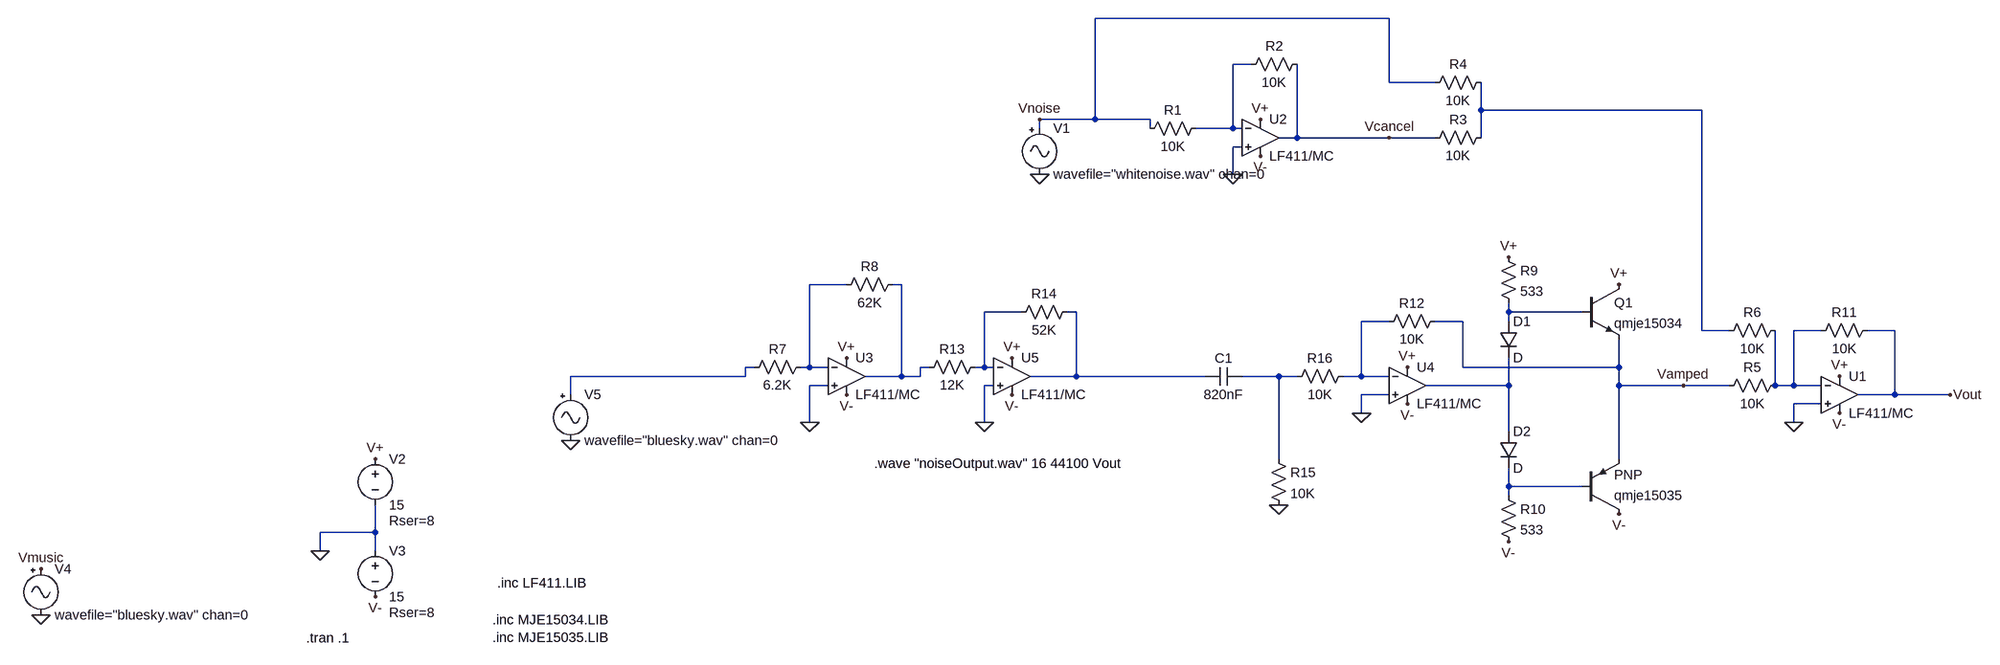
[diagram p0: schematic noiseCanceller.asc]
noiseCanceller.asc, the LTspice schematic file:
Version 4
SHEET 1 3320 732
WIRE 1968 -368 1456 -368
WIRE 1728 -288 1696 -288
WIRE 1968 -256 1968 -368
WIRE 2048 -256 1968 -256
WIRE 2128 -208 2128 -256
WIRE 2512 -208 2128 -208
WIRE 1456 -192 1456 -368
WIRE 1456 -192 1360 -192
WIRE 1552 -192 1456 -192
WIRE 1360 -176 1360 -192
WIRE 1552 -176 1552 -192
WIRE 1696 -176 1696 -288
WIRE 1696 -176 1632 -176
WIRE 1712 -176 1696 -176
WIRE 1808 -160 1808 -288
WIRE 1808 -160 1776 -160
WIRE 1968 -160 1808 -160
WIRE 2048 -160 1968 -160
WIRE 2128 -160 2128 -208
WIRE 1712 -144 1696 -144
WIRE 1696 -96 1696 -144
WIRE 1024 96 960 96
WIRE 1120 96 1104 96
WIRE 1328 144 1264 144
WIRE 1424 144 1408 144
WIRE 2176 144 2176 128
WIRE 2304 144 2176 144
WIRE 1968 160 1920 160
WIRE 2096 160 2048 160
WIRE 2176 160 2176 144
WIRE 2512 176 2512 -208
WIRE 2560 176 2512 176
WIRE 2720 176 2672 176
WIRE 2848 176 2800 176
WIRE 864 240 848 240
WIRE 960 240 960 96
WIRE 960 240 944 240
WIRE 992 240 960 240
WIRE 1168 240 1152 240
WIRE 1264 240 1264 144
WIRE 1264 240 1248 240
WIRE 1280 240 1264 240
WIRE 2096 240 2096 160
WIRE 2368 240 2368 192
WIRE 2368 240 2096 240
WIRE 848 256 848 240
WIRE 848 256 544 256
WIRE 1120 256 1120 96
WIRE 1120 256 1056 256
WIRE 1152 256 1152 240
WIRE 1152 256 1120 256
WIRE 1424 256 1424 144
WIRE 1424 256 1344 256
WIRE 1648 256 1424 256
WIRE 1776 256 1712 256
WIRE 1808 256 1776 256
WIRE 1920 256 1920 160
WIRE 1920 256 1888 256
WIRE 1968 256 1920 256
WIRE 992 272 960 272
WIRE 1280 272 1264 272
WIRE 2176 272 2176 224
WIRE 2176 272 2032 272
WIRE 2368 272 2368 240
WIRE 2480 272 2368 272
WIRE 2560 272 2480 272
WIRE 2640 272 2640 176
WIRE 2672 272 2672 176
WIRE 2672 272 2640 272
WIRE 2720 272 2672 272
WIRE 544 288 544 256
WIRE 1968 288 1920 288
WIRE 2848 288 2848 176
WIRE 2848 288 2784 288
WIRE 2944 288 2848 288
WIRE 2720 304 2672 304
WIRE 1920 320 1920 288
WIRE 960 336 960 272
WIRE 1264 336 1264 272
WIRE 2672 336 2672 304
WIRE 2176 352 2176 272
WIRE 1776 400 1776 256
WIRE 2368 400 2368 272
WIRE 2176 448 2176 416
WIRE 2304 448 2176 448
WIRE 2176 464 2176 448
WIRE 64 528 64 480
WIRE 64 528 -32 528
WIRE -32 560 -32 528
WIRE 64 560 64 528
FLAG 1696 -96 0
FLAG -32 560 0
FLAG 64 400 V+
FLAG 1744 -192 V+
FLAG 64 640 V-
FLAG 1744 -128 V-
FLAG 1360 -96 0
FLAG 1360 -192 Vnoise
FLAG -656 672 0
FLAG -656 592 Vmusic
FLAG 1968 -160 Vcancel
FLAG 960 336 0
FLAG 1024 224 V+
FLAG 1024 288 V-
FLAG 2176 48 V+
FLAG 2176 544 V-
FLAG 2368 96 V+
FLAG 2368 496 V-
FLAG 1312 224 V+
FLAG 1312 288 V-
FLAG 1264 336 0
FLAG 1776 480 0
FLAG 544 368 0
FLAG 2752 256 V+
FLAG 2752 320 V-
FLAG 2672 336 0
FLAG 2944 288 Vout
FLAG 2480 272 Vamped
FLAG 2000 240 V+
FLAG 2000 304 V-
FLAG 1920 320 0
SYMBOL Misc\\signal 1360 -192 R0
WINDOW 123 0 0 Left 0
WINDOW 39 0 0 Left 0
SYMATTR InstName V1
SYMATTR Value wavefile="whitenoise.wav" chan=0
SYMBOL voltage 64 384 R0
WINDOW 123 0 0 Left 0
WINDOW 39 24 124 Left 2
SYMATTR SpiceLine Rser=8
SYMATTR InstName V2
SYMATTR Value 15
SYMBOL voltage 64 544 R0
WINDOW 123 0 0 Left 0
WINDOW 39 24 124 Left 2
SYMATTR SpiceLine Rser=8
SYMATTR InstName V3
SYMATTR Value 15
SYMBOL res 1648 -192 R90
WINDOW 0 0 56 VBottom 2
WINDOW 3 32 56 VTop 2
SYMATTR InstName R1
SYMATTR Value 10K
SYMBOL res 1824 -304 R90
WINDOW 0 0 56 VBottom 2
WINDOW 3 32 56 VTop 2
SYMATTR InstName R2
SYMATTR Value 10K
SYMBOL res 2144 -176 R90
WINDOW 0 0 56 VBottom 2
WINDOW 3 32 56 VTop 2
SYMATTR InstName R3
SYMATTR Value 10K
SYMBOL res 2144 -272 R90
WINDOW 0 0 56 VBottom 2
WINDOW 3 32 56 VTop 2
SYMATTR InstName R4
SYMATTR Value 10K
SYMBOL Misc\\signal -656 576 R0
WINDOW 123 0 0 Left 0
WINDOW 39 0 0 Left 0
SYMATTR InstName V4
SYMATTR Value wavefile="bluesky.wav" chan=0
SYMBOL Opamps\\opamp2 1744 -224 R0
SYMATTR InstName U2
SYMATTR Value LF411/MC
SYMBOL Opamps\\opamp2 1024 192 R0
SYMATTR InstName U3
SYMATTR Value LF411/MC
SYMBOL res 960 224 R90
WINDOW 0 0 56 VBottom 2
WINDOW 3 32 56 VTop 2
SYMATTR InstName R7
SYMATTR Value 6.2K
SYMBOL res 1120 80 R90
WINDOW 0 0 56 VBottom 2
WINDOW 3 32 56 VTop 2
SYMATTR InstName R8
SYMATTR Value 62K
SYMBOL res 2160 32 R0
SYMATTR InstName R9
SYMATTR Value 533
SYMBOL res 2160 448 R0
SYMATTR InstName R10
SYMATTR Value 533
SYMBOL diode 2160 160 R0
SYMATTR InstName D1
SYMBOL diode 2160 352 R0
SYMATTR InstName D2
SYMBOL npn 2304 96 R0
SYMATTR InstName Q1
SYMATTR Value qmje15034
SYMBOL pnp 2304 496 M180
SYMATTR InstName qmje15035
SYMBOL Opamps\\opamp2 1312 192 R0
SYMATTR InstName U5
SYMATTR Value LF411/MC
SYMBOL res 1264 224 R90
WINDOW 0 0 56 VBottom 2
WINDOW 3 32 56 VTop 2
SYMATTR InstName R13
SYMATTR Value 12K
SYMBOL res 1424 128 R90
WINDOW 0 0 56 VBottom 2
WINDOW 3 32 56 VTop 2
SYMATTR InstName R14
SYMATTR Value 52K
SYMBOL cap 1712 240 R90
WINDOW 0 0 32 VBottom 2
WINDOW 3 32 32 VTop 2
SYMATTR InstName C1
SYMATTR Value 820nF
SYMBOL res 1760 384 R0
SYMATTR InstName R15
SYMATTR Value 10K
SYMBOL Misc\\signal 544 272 R0
WINDOW 123 0 0 Left 0
WINDOW 39 0 0 Left 0
SYMATTR InstName V5
SYMATTR Value wavefile="bluesky.wav" chan=0
SYMBOL res 2656 256 R90
WINDOW 0 0 56 VBottom 2
WINDOW 3 32 56 VTop 2
SYMATTR InstName R5
SYMATTR Value 10K
SYMBOL res 2656 160 R90
WINDOW 0 0 56 VBottom 2
WINDOW 3 32 56 VTop 2
SYMATTR InstName R6
SYMATTR Value 10K
SYMBOL Opamps\\opamp2 2752 224 R0
SYMATTR InstName U1
SYMATTR Value LF411/MC
SYMBOL res 2816 160 R90
WINDOW 0 0 56 VBottom 2
WINDOW 3 32 56 VTop 2
SYMATTR InstName R11
SYMATTR Value 10K
SYMBOL Opamps\\opamp2 2000 208 R0
SYMATTR InstName U4
SYMATTR Value LF411/MC
SYMBOL res 2064 144 R90
WINDOW 0 0 56 VBottom 2
WINDOW 3 32 56 VTop 2
SYMATTR InstName R12
SYMATTR Value 10K
SYMBOL res 1904 240 R90
WINDOW 0 0 56 VBottom 2
WINDOW 3 32 56 VTop 2
SYMATTR InstName R16
SYMATTR Value 10K
TEXT -56 712 Left 2 !.tran .1
TEXT 416 616 Left 2 !.inc LF411.LIB
TEXT 1072 408 Left 2 !.wave "noiseOutput.wav" 16 44100 Vout
TEXT 408 680 Left 2 !.inc MJE15034.LIB\n.inc MJE15035.LIB

The netlist it stands for:
* noiseCanceller.asc
V1 Vnoise 0 wavefile="whitenoise.wav" chan=0
V2 V+ 0 15 Rser=8
V3 0 V- 15 Rser=8
R1 N001 Vnoise 10K
R2 Vcancel N001 10K
R3 N002 Vcancel 10K
R4 N002 Vnoise 10K
V4 Vmusic 0 wavefile="bluesky.wav" chan=0
XU2 0 N001 V+ V- Vcancel LF411/MC  ; pins In+ In- V+ V- OUT
XU3 0 N003 V+ V- N004 LF411/MC  ; pins In+ In- V+ V- OUT
R7 N003 N010 6.2K
R8 N004 N003 62K
R9 V+ N007 533
R10 N013 V- 533
D1 N007 N012 D
D2 N012 N013 D
Q1 V+ N007 Vamped 0 qmje15034
qmje15035 V- N013 Vamped 0 PNP
XU5 0 N005 V+ V- N006 LF411/MC  ; pins In+ In- V+ V- OUT
R13 N005 N004 12K
R14 N006 N005 52K
C1 N011 N006 820nF
R15 N011 0 10K
V5 N010 0 wavefile="bluesky.wav" chan=0
R5 N009 Vamped 10K
R6 N009 N002 10K
XU1 0 N009 V+ V- Vout LF411/MC  ; pins In+ In- V+ V- OUT
R11 Vout N009 10K
XU4 0 N008 V+ V- N012 LF411/MC  ; pins In+ In- V+ V- OUT
R12 Vamped N008 10K
R16 N008 N011 10K
.model D D
.lib standard.dio
.model NPN NPN
.model PNP PNP
.lib standard.bjt
.tran .1
.inc LF411.LIB
.wave "noiseOutput.wav" 16 44100 Vout
.inc MJE15034.LIB
.inc MJE15035.LIB
.backanno
.end